# Altium schematic sheet jtag.schdoc
size 315 x 219 mm; SheetNumber: 1; SheetTotal: 2
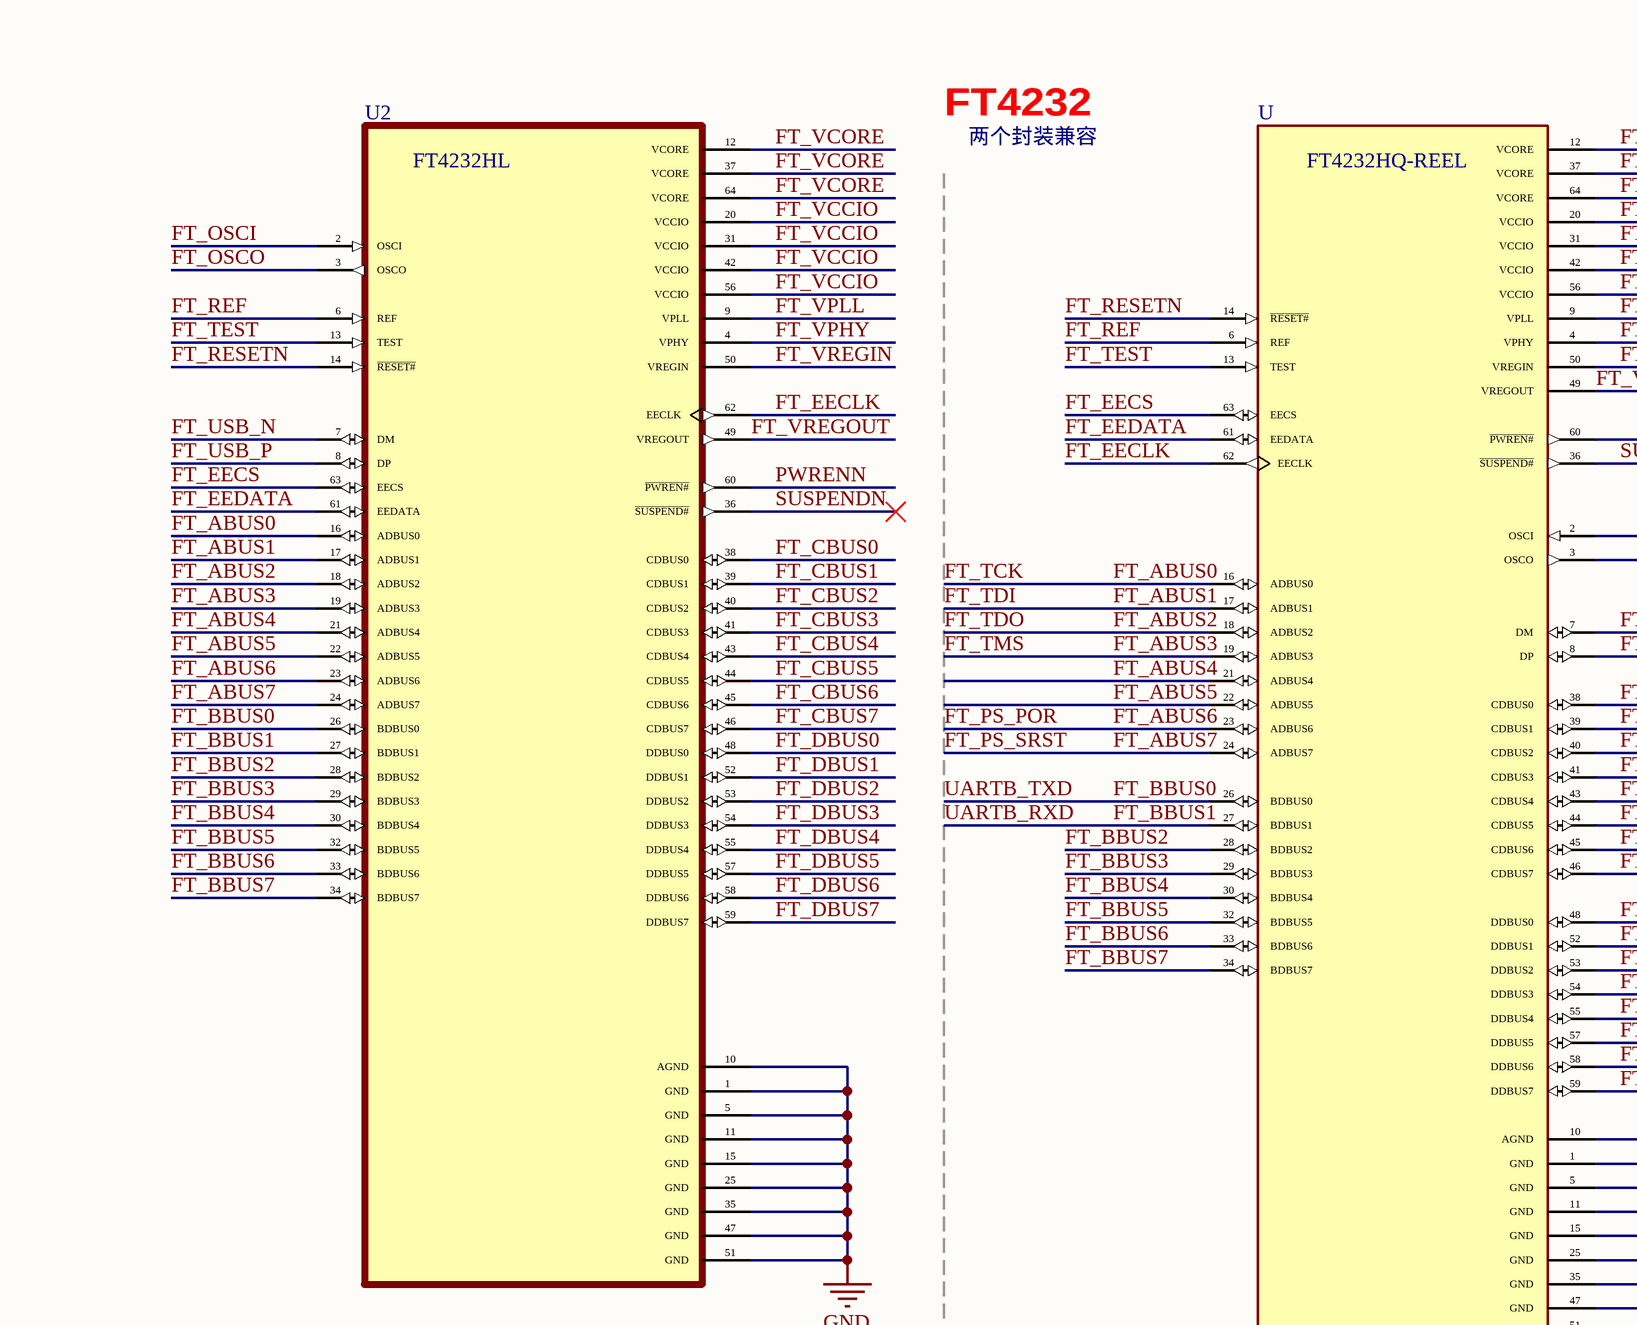
[diagram p0: jtag.schdoc, top left]
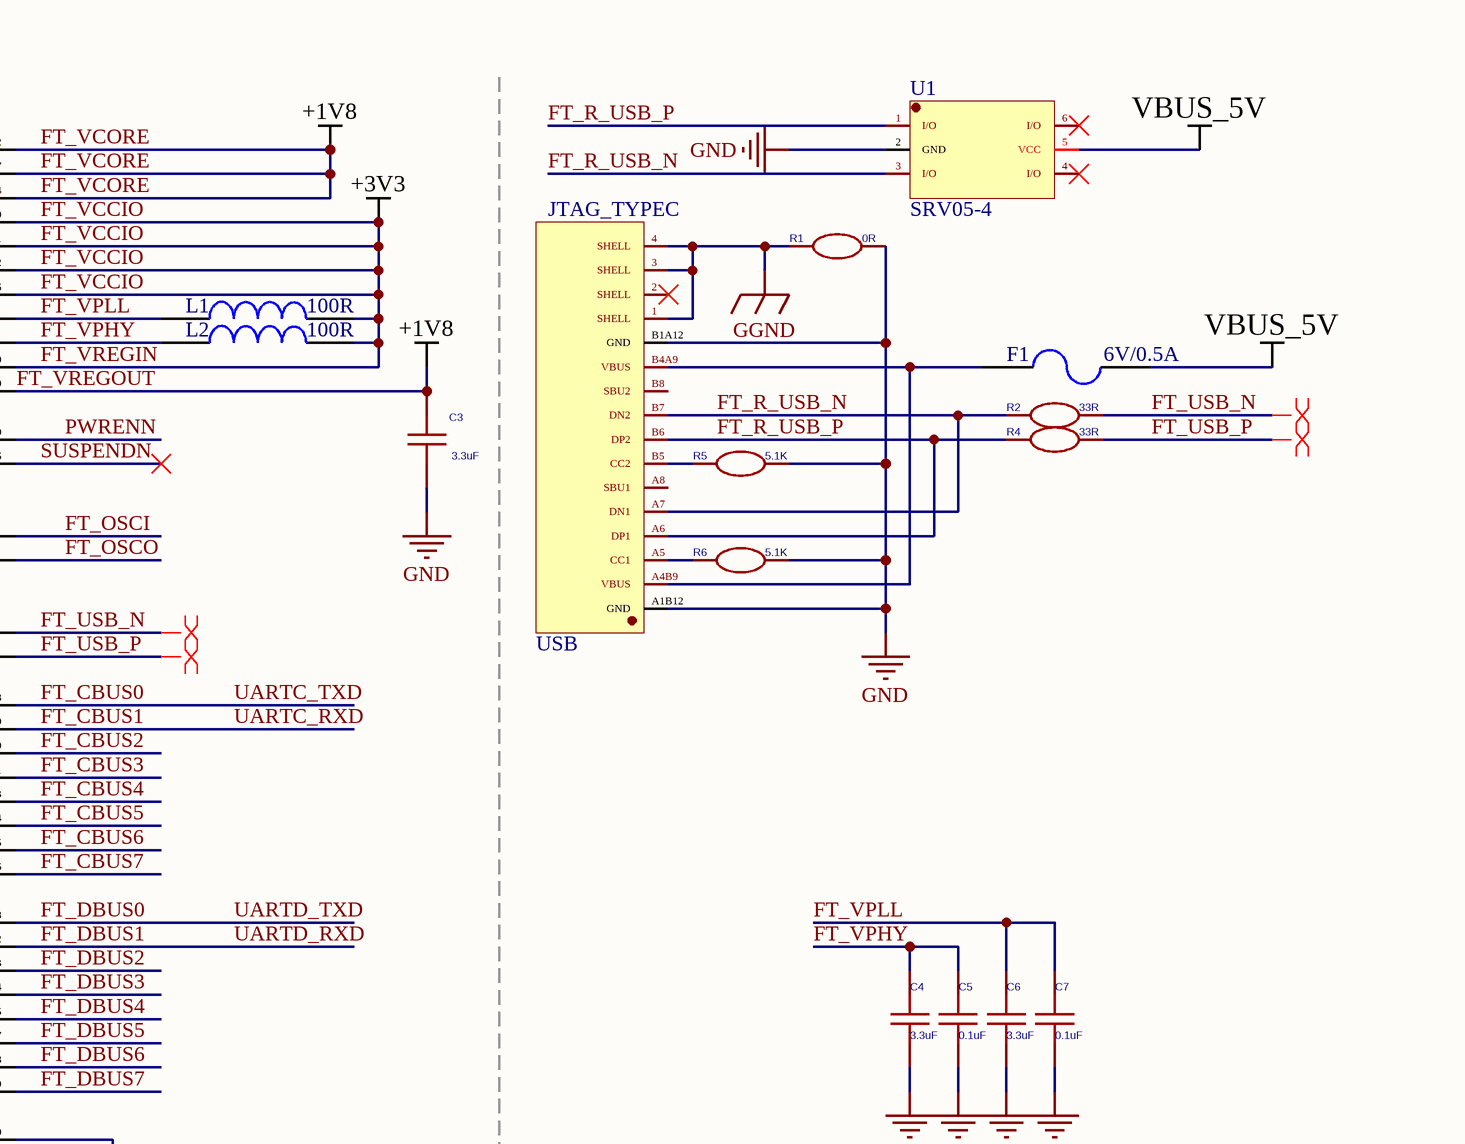
[diagram p1: jtag.schdoc, top right]
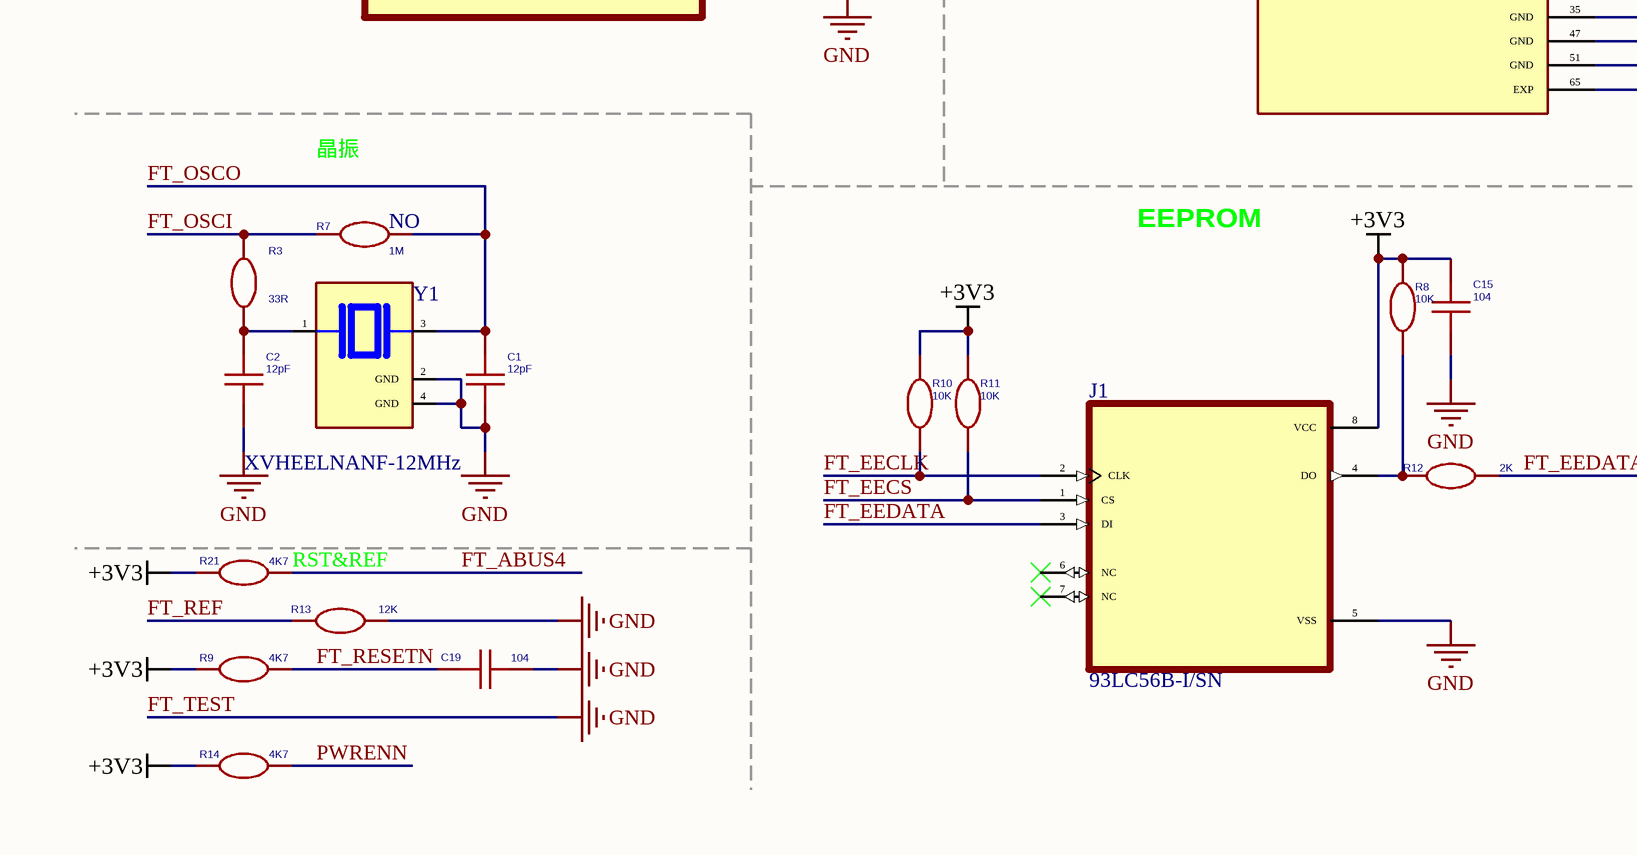
[diagram p2: jtag.schdoc, bottom left]
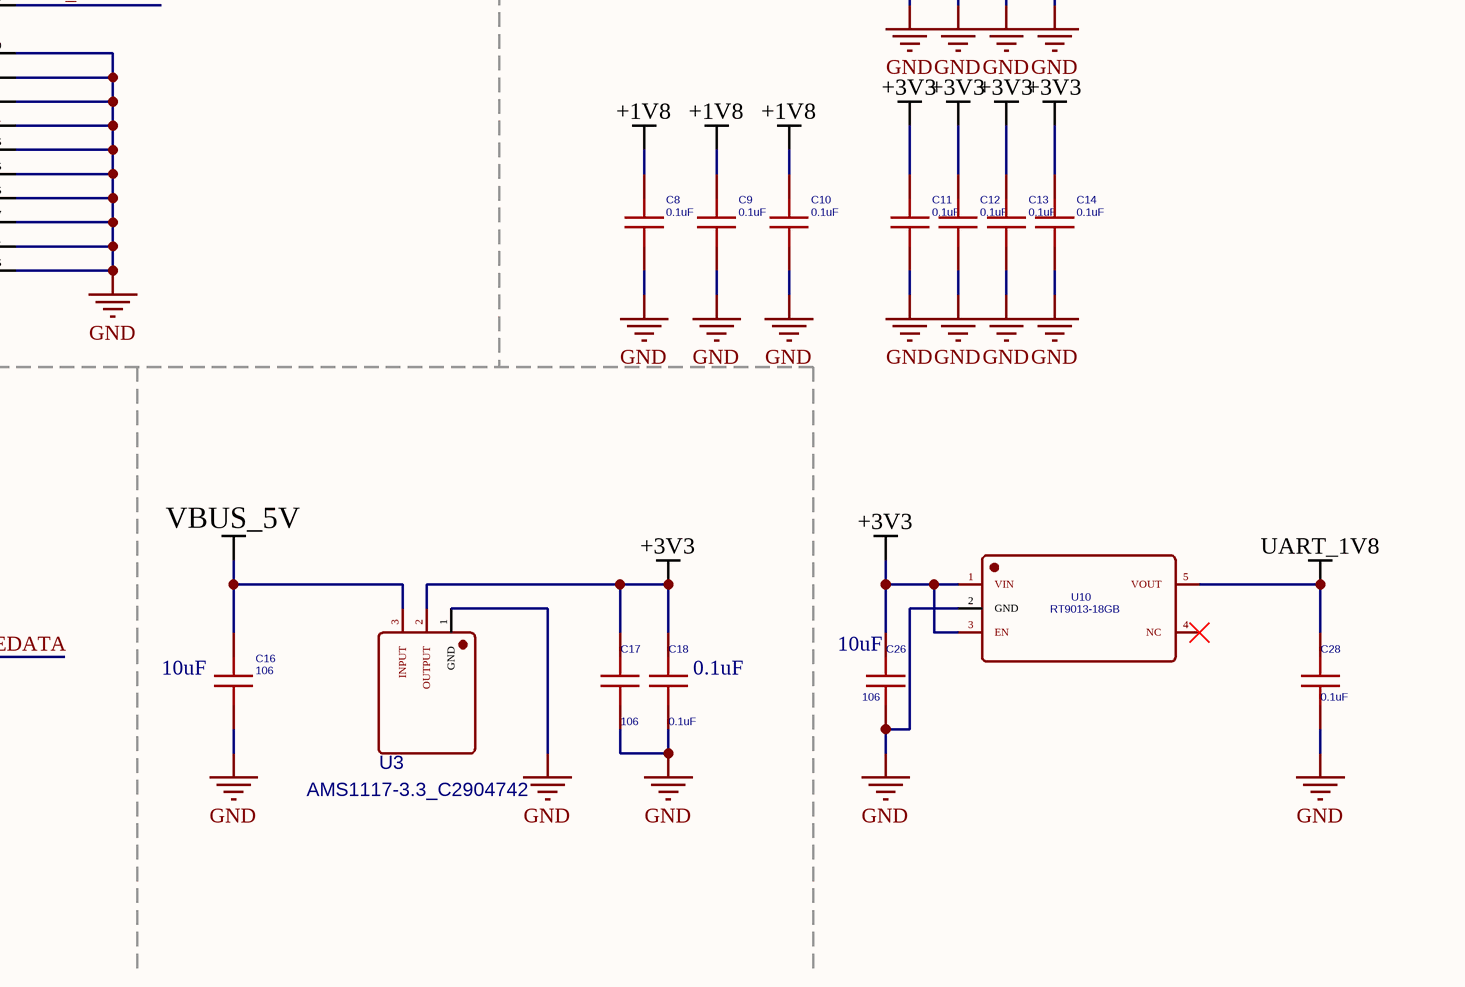
[diagram p3: jtag.schdoc, bottom right]

## Parts
C1  12pF  [0603C]
C2  12pF  [0603C]
C3  3.3uF  [0603C]
C4  3.3uF  [0603C]
C5  0.1uF  [0603C]
C6  3.3uF  [0603C]
C7  0.1uF  [0603C]
C8  0.1uF  [0603C]
C9  0.1uF  [0603C]
C10  0.1uF  [0603C]
C11  0.1uF  [0603C]
C12  0.1uF  [0603C]
C13  0.1uF  [0603C]
C14  0.1uF  [0603C]
C15  104  [0603C]
C16  106  [0603C]
C17  106  [0603C]
C18  0.1uF  [0603C]
C19  104  [0603C]
C26  106  [0603C]
C28  0.1uF  [0603C]
F1  6V/0.5A  [FUSE-1812]
J1  93LC56B-I/SN  [SOIC127P599X175-8N]
JTAG_TYPEC  USB  [USB-C-16PIN]
L1  100R  [0805L]
L2  100R  [0805L]
R1  0R  [0603R]
R2  33R  [0603R]
R3  33R  [0603R]
R4  33R  [0603R]
R5  5.1K  [0603R]
R6  5.1K  [0603R]
R7  1M  STUFF: NO  [0603R]
R8  10K  [0603R]
R9  4K7  [0603R]
R10  10K  [0603R]
R11  10K  [0603R]
R12  2K  [0603R]
R13  12K  [0603R]
R14  4K7  [0603R]
R21  4K7  [0603R]
U  FT4232HQ-REEL  [QFN50P900X900X105-65N]
U1  SRV05-4  [SOT23-6]
U2  FT4232HL  [QFP50P1200X1200X160-64N]
U3  AMS1117-3.3_C2904742  [SOT-89-3_L4.5-W2.5-P1.50-LS4.1-BL]
U10  RT9013-18GB  [SOT-23-5_L3.0-W1.7-P0.95-LS2.8-BR]
Y1  XVHEELNANF-12MHz  [XTAL_ABM8G-12.000MHZ-B4Y-T]

## Nets
FT_TEST: C1.2 C2.2 C3.1 C4.1 C5.1 C6.1 C7.1 C8.1 C9.1 C10.1 C11.1 C12.1 C13.1 C14.1 C15.1 C16.1 C17.1 C18.1 C19.2 C26.1 C28.1 J1.5(VSS) JTAG_TYPEC.A1B12(GND) JTAG_TYPEC.B1A12(GND) R1.1 R5.1 R6.1 R13.2 U.1(GND) U.5(GND) U.10(AGND) U.11(GND) U.13(TEST) U.15(GND) U.25(GND) U.35(GND) U.47(GND) U.51(GND) U.65(EXP) U1.2(GND) U2.1(GND) U2.5(GND) U2.10(AGND) U2.11(GND) U2.13(TEST) U2.15(GND) U2.25(GND) U2.35(GND) U2.47(GND) U2.51(GND) U3.1(GND) U10.2(GND) Y1.2(GND) Y1.4(GND)  [also labelled GND]
FT_VCCIO: C11.2 C12.2 C13.2 C14.2 C15.2 C17.2 C18.2 C26.2 J1.8(VCC) L1.2 L2.2 R8.2 R9.1 R10.2 R11.2 R14.1 R21.1 U.20(VCCIO) U.31(VCCIO) U.42(VCCIO) U.50(VREGIN) U.56(VCCIO) U2.20(VCCIO) U2.31(VCCIO) U2.42(VCCIO) U2.50(VREGIN) U2.56(VCCIO) U3.2(OUTPUT) U10.1(VIN) U10.3(EN)  [also labelled +3V3, FT_VREGIN]
FT_VCORE: C3.2 C8.2 C9.2 C10.2 U.12(VCORE) U.37(VCORE) U.49(VREGOUT) U.64(VCORE) U2.12(VCORE) U2.37(VCORE) U2.49(VREGOUT) U2.64(VCORE)  [also labelled +1V8, FT_VREGOUT]
GGND: JTAG_TYPEC.1(SHELL) JTAG_TYPEC.3(SHELL) JTAG_TYPEC.4(SHELL) R1.2
UART_1V8: C28.2 U10.5(VOUT)
VBUS_5V: C16.2 F1.2 U1.5(VCC) U3.3(INPUT)
FT_ABUS0: U.16(ADBUS0) U2.16(ADBUS0)  [also labelled FT_TCK]
FT_ABUS1: U.17(ADBUS1) U2.17(ADBUS1)  [also labelled FT_TDI]
FT_ABUS2: U.18(ADBUS2) U2.18(ADBUS2)  [also labelled FT_TDO]
FT_ABUS3: U.19(ADBUS3) U2.19(ADBUS3)  [also labelled FT_TMS]
FT_ABUS4: R21.2 U.21(ADBUS4) U2.21(ADBUS4)
FT_ABUS5: U.22(ADBUS5) U2.22(ADBUS5)
FT_ABUS6: U.23(ADBUS6) U2.23(ADBUS6)  [also labelled FT_PS_POR]
FT_ABUS7: U.24(ADBUS7) U2.24(ADBUS7)  [also labelled FT_PS_SRST]
FT_BBUS0: U.26(BDBUS0) U2.26(BDBUS0)  [also labelled UARTB_TXD]
FT_BBUS1: U.27(BDBUS1) U2.27(BDBUS1)  [also labelled UARTB_RXD]
FT_BBUS2: U.28(BDBUS2) U2.28(BDBUS2)
FT_BBUS3: U.29(BDBUS3) U2.29(BDBUS3)
FT_BBUS4: U.30(BDBUS4) U2.30(BDBUS4)
FT_BBUS5: U.32(BDBUS5) U2.32(BDBUS5)
FT_BBUS6: U.33(BDBUS6) U2.33(BDBUS6)
FT_BBUS7: U.34(BDBUS7) U2.34(BDBUS7)
FT_CBUS0: U.38(CDBUS0) U2.38(CDBUS0)  [also labelled UARTC_TXD]
FT_CBUS1: U.39(CDBUS1) U2.39(CDBUS1)  [also labelled UARTC_RXD]
FT_CBUS2: U.40(CDBUS2) U2.40(CDBUS2)
FT_CBUS3: U.41(CDBUS3) U2.41(CDBUS3)
FT_CBUS4: U.43(CDBUS4) U2.43(CDBUS4)
FT_CBUS5: U.44(CDBUS5) U2.44(CDBUS5)
FT_CBUS6: U.45(CDBUS6) U2.45(CDBUS6)
FT_CBUS7: U.46(CDBUS7) U2.46(CDBUS7)
FT_DBUS0: U.48(DDBUS0) U2.48(DDBUS0)  [also labelled UARTD_TXD]
FT_DBUS1: U.52(DDBUS1) U2.52(DDBUS1)  [also labelled UARTD_RXD]
FT_DBUS2: U.53(DDBUS2) U2.53(DDBUS2)
FT_DBUS3: U.54(DDBUS3) U2.54(DDBUS3)
FT_DBUS4: U.55(DDBUS4) U2.55(DDBUS4)
FT_DBUS5: U.57(DDBUS5) U2.57(DDBUS5)
FT_DBUS6: U.58(DDBUS6) U2.58(DDBUS6)
FT_DBUS7: U.59(DDBUS7) U2.59(DDBUS7)
FT_EECLK: J1.2(CLK) R10.1 U.62(EECLK) U2.62(EECLK)
FT_EECS: J1.1(CS) R11.1 U.63(EECS) U2.63(EECS)
FT_EEDATA: J1.3(DI) R12.2 U.61(EEDATA) U2.61(EEDATA)
FT_OSCI: R3.2 R7.2 U.2(OSCI) U2.2(OSCI)
FT_OSCO: C1.1 R7.1 U.3(OSCO) U2.3(OSCO) Y1.3
FT_R_USB_N: JTAG_TYPEC.A7(DN1) JTAG_TYPEC.B7(DN2) R2.2 U1.3(I/O)
FT_R_USB_P: JTAG_TYPEC.A6(DP1) JTAG_TYPEC.B6(DP2) R4.2 U1.1(I/O)
FT_REF: R13.1 U.6(REF) U2.6(REF)
FT_RESETN: C19.1 R9.2 U.14(~{RESET#}) U2.14(~{RESET#})
FT_USB_N: R2.1 U.7(DM) U2.7(DM)
FT_USB_P: R4.1 U.8(DP) U2.8(DP)
FT_VPHY: C4.2 C5.2 L2.1 U.4(VPHY) U2.4(VPHY)
FT_VPLL: C6.2 C7.2 L1.1 U.9(VPLL) U2.9(VPLL)
PWRENN: R14.2 U.60(~{PWREN#}) U2.60(~{PWREN#})
SUSPENDN: U.36(~{SUSPEND#}) U2.36(~{SUSPEND#})
NetC2_1: C2.1 R3.1 Y1.1
NetF1_1: F1.1 JTAG_TYPEC.A4B9(VBUS) JTAG_TYPEC.B4A9(VBUS)
NetJ1_4: J1.4(DO) R8.1 R12.1
NetJTAG_TYPEC_A5: JTAG_TYPEC.A5(CC1) R6.2
NetJTAG_TYPEC_B5: JTAG_TYPEC.B5(CC2) R5.2

Not connected (* = marked no-connect by the designer): J1 6(NC)* 7(NC)*; JTAG_TYPEC 2(SHELL)* A8(SBU1) B8(SBU2); U1 4(I/O)* 6(I/O)*; U10 4(NC)*

## Layout directives
differential pair: FT_USB_N, FT_USB_P

## Notes on the sheet
- FT4232
- 两个封装兼容
- (near R7) 晶振
- EEPROM
- (near C16) 10uF
- (near C18) 0.1uF
- (near C26) 10uF
- (near R21) RST&REF

## Library data of the parts
C1 C2 = 12pF: nameAlias: Value(F); Contributor: LCEDA_Lib; spicePre: C; spiceSymbolName: C_0603_US
C3-C15 C18 C19 C28 = 104: nameAlias: Value(F); Contributor: LCEDA_Lib; spicePre: C; spiceSymbolName: C_0603_US
C16 C17 C26 = 106: nameAlias: Value(F); Contributor: LCEDA_Lib; spicePre: C; spiceSymbolName: C_0603_US
F1 = FUSE
J1 = 93LC56B-I/SN: EEPROM Memory IC 2Kb (128 x 16) SPI 3MHz 8-SOIC; MF: Microchip; Check_prices: https://www.snapeda.com/parts/93LC56B-I/SN/Microchip/view-part/7949/?ref=eda; Purchase-URL: https://pricing.snapeda.com/search/part/93LC56B-I/SN/?ref=eda; Digi-Key_Part_Number: 93LC56B-I/SN15KVAO-ND; Package: SOIC-8 Microchip; SnapEDA_Link: https://www.snapeda.com/parts/93LC56B-I/SN/Microchip/view-part/7949/?ref=snap; MP: 93LC56B-I/SN; Value: *
JTAG_TYPEC = USB-C-16PIN
L1 L2 = INDUCTOR
R1-R8 R10-R12 = 10K: nameAlias: Value(Ω); Contributor: LCEDA_Lib; spicePre: R; spiceSymbolName: R_0603_EU
R9 R14 R21 = 4K7: nameAlias: Value(Ω); Contributor: LCEDA_Lib; spicePre: R; spiceSymbolName: R_0603_EU
R13 = 12K: nameAlias: Value(Ω); Contributor: LCEDA_Lib; spicePre: R; spiceSymbolName: R_0603_EU
U = FT4232HQ-REEL: USB Bridge, USB to UART USB 2.0 UART Interface 64-QFN _9x9_; MF: FTDI, Future; Value: *; SnapEDA_Link: https://www.snapeda.com/parts/FT4232HQ-REEL/FTDI%2C%20Future%20Technology%20Devices%20International%20Ltd/view-part/440352/?ref=snap; Digi-Key_Purchase_URL: https://www.digikey.in/product-detail/en/ftdi-future-technology-devices-international-ltd/FT4232HQ-REEL/768-1027-1-ND/1986060?utm_source=snapeda&utm_medium=aggregator&utm_campaign=symbol; MP: FT4232HQ-REEL; Digi-Key_Part_Number: 768-1027-1-ND; Package: QFN-64 FTDI
U2 = FT4232HL: USB Hi-Speed to Quad Channel Serial UART/JTAG/SPI/I2C IC - LQFP-64; Price: None; MP: FT4232HL; Availability: Unavailable; Value: *; Package: None
U3 = AMS1117-3.3_C2904742: BOM_Manufacturer: YONGYUTAI(永裕泰); Contributor: LCSC; BOM_Supplier: LCSC; BOM_Supplier Part: C2904742; BOM_Manufacturer Part: AMS1117-3.3; BOM_JLCPCB Part Class: Extended Part; spicePre: U; spiceSymbolName: AMS1117-3.3_C2904742
U10 = RT9013-18GB: BOM_Manufacturer: RICHTEK(立锜); BOM_Supplier: LCSC; BOM_Manufacturer Part: RT9013-18GB; BOM_Supplier Part: C59969; BOM_JLCPCB Part Class: Extended Part; spicePre: U; spiceSymbolName: RT9013-18GB
Y1 = ABM8G-12.000MHZ-B4Y-T: 12 MHz Â±30ppm Crystal 10pF 120 Ohms 4-SMD, No Lead; MF: Abracon; Purchase-URL: https://pricing.snapeda.com/search/part/ABM8G-12.000MHZ-B4Y-T/?ref=eda; SnapEDA_Link: https://www.snapeda.com/parts/ABM8G-12.000MHZ-B4Y-T/Abracon+LLC/view-part/?ref=snap; Price: None; Check_prices: https://www.snapeda.com/parts/ABM8G-12.000MHZ-B4Y-T/Abracon+LLC/view-part/?ref=eda; MP: ABM8G-12.000MHZ-B4Y-T; Value: *; Availability: In Stock; Package: SMD-4 Abracon